# Altium schematic sheet controller.SchDoc
size A4
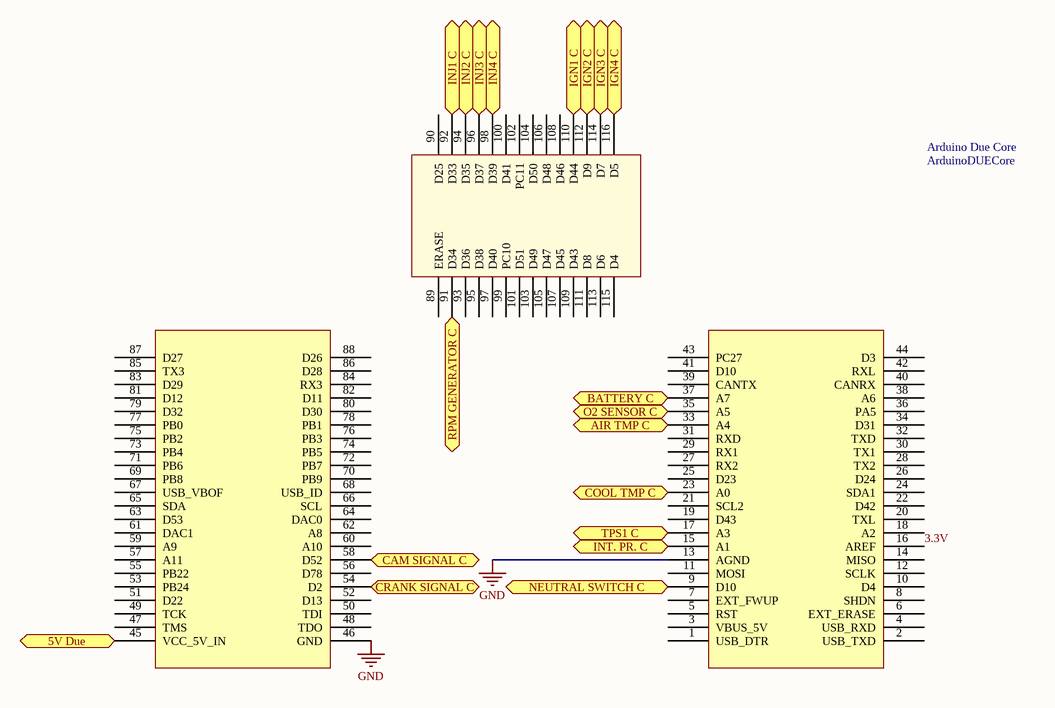
[diagram p0: controller.SchDoc]

## Parts
Arduino_Due_Core  ArduinoDUECore  [ARDUINO DUE CORE]

## Ports
5V Due (bidir), AIR TMP C (bidir), BATTERY C (bidir), CAM SIGNAL C (bidir), COOL TMP C (bidir), CRANK SIGNAL C (bidir), IGN1 C (bidir), IGN2 C (bidir), IGN3 C (bidir), IGN4 C (bidir), INJ1 C (bidir), INJ2 C (bidir), INJ3 C (bidir), INJ4 C (bidir), INT. PR. C (bidir), NEUTRAL SWITCH C (bidir), O2 SENSOR C (bidir), RPM GENERATOR C (bidir), TPS1 C (bidir)

## Nets
GND: Arduino_Due_Core.13(AGND) Arduino_Due_Core.46(GND)
3.3V: Arduino_Due_Core.16(AREF)
5V Due: Arduino_Due_Core.45(VCC_5V_IN) ; port 5V Due
AIR TMP C: Arduino_Due_Core.33(A4) ; port AIR TMP C
BATTERY C: Arduino_Due_Core.37(A7) ; port BATTERY C
CAM SIGNAL C: Arduino_Due_Core.58(D52) ; port CAM SIGNAL C
COOL TMP C: Arduino_Due_Core.23(A0) ; port COOL TMP C
CRANK SIGNAL C: Arduino_Due_Core.54(D2) ; port CRANK SIGNAL C
IGN1 C: Arduino_Due_Core.110(D44) ; port IGN1 C
IGN2 C: Arduino_Due_Core.112(D9) ; port IGN2 C
IGN3 C: Arduino_Due_Core.114(D7) ; port IGN3 C
IGN4 C: Arduino_Due_Core.116(D5) ; port IGN4 C
INJ1 C: Arduino_Due_Core.92(D33) ; port INJ1 C
INJ2 C: Arduino_Due_Core.94(D35) ; port INJ2 C
INJ3 C: Arduino_Due_Core.96(D37) ; port INJ3 C
INJ4 C: Arduino_Due_Core.98(D39) ; port INJ4 C
INT. PR. C: Arduino_Due_Core.15(A1) ; port INT. PR. C
NEUTRAL SWITCH C: Arduino_Due_Core.9(D10) ; port NEUTRAL SWITCH C
O2 SENSOR C: Arduino_Due_Core.35(A5) ; port O2 SENSOR C
RPM GENERATOR C: Arduino_Due_Core.91(D34) ; port RPM GENERATOR C
TPS1 C: Arduino_Due_Core.17(A3) ; port TPS1 C

Not connected (* = marked no-connect by the designer): Arduino_Due_Core 1(USB_DTR) 2(USB_TXD) 3(VBUS_5V) 4(USB_RXD) 5(RST) 6(EXT_ERASE) 7(EXT_FWUP) 8(SHDN) 10(D4) 11(MOSI) 12(SCLK) 14(MISO) 18(A2) 19(D43) 20(TXL) 21(SCL2) 22(D42) 24(SDA1) 25(D23) 26(D24) 27(RX2) 28(TX2) 29(RX1) 30(TX1) 31(RXD) 32(TXD) 34(D31) 36(PA5) 38(A6) 39(CANTX) 40(CANRX) 41(D10) 42(RXL) 43(PC27) 44(D3) 47(TMS) 48(TDO) 49(TCK) 50(TDI) 51(D22) 52(D13) 53(PB24) 55(PB22) 56(D78) 57(A11) 59(A9) 60(A10) 61(DAC1) 62(A8) 63(D53) 64(DAC0) 65(SDA) 66(SCL) 67(USB_VBOF) 68(USB_ID) 69(PB8) 70(PB9) 71(PB6) 72(PB7) 73(PB4) 74(PB5) 75(PB2) 76(PB3) 77(PB0) 78(PB1) 79(D32) 80(D30) 81(D12) 82(D11) 83(D29) 84(RX3) 85(TX3) 86(D28) 87(D27) 88(D26) 89(ERASE) 90(D25) 93(D36) 95(D38) 97(D40) 99(PC10) 100(D41) 101(D51) 102(PC11) 103(D49) 104(D50) 105(D47) 106(D48) 107(D45) 108(D46) 109(D43) 111(D8) 113(D6) 115(D4)